# Altium schematic sheet cc2520_cc2592.SchDoc: Edison Gateway - CC2520
size Letter; Author: Ye-Sheng Kuo; DocumentNumber: 9; Revision: 3; SheetNumber: 9; SheetTotal: 10
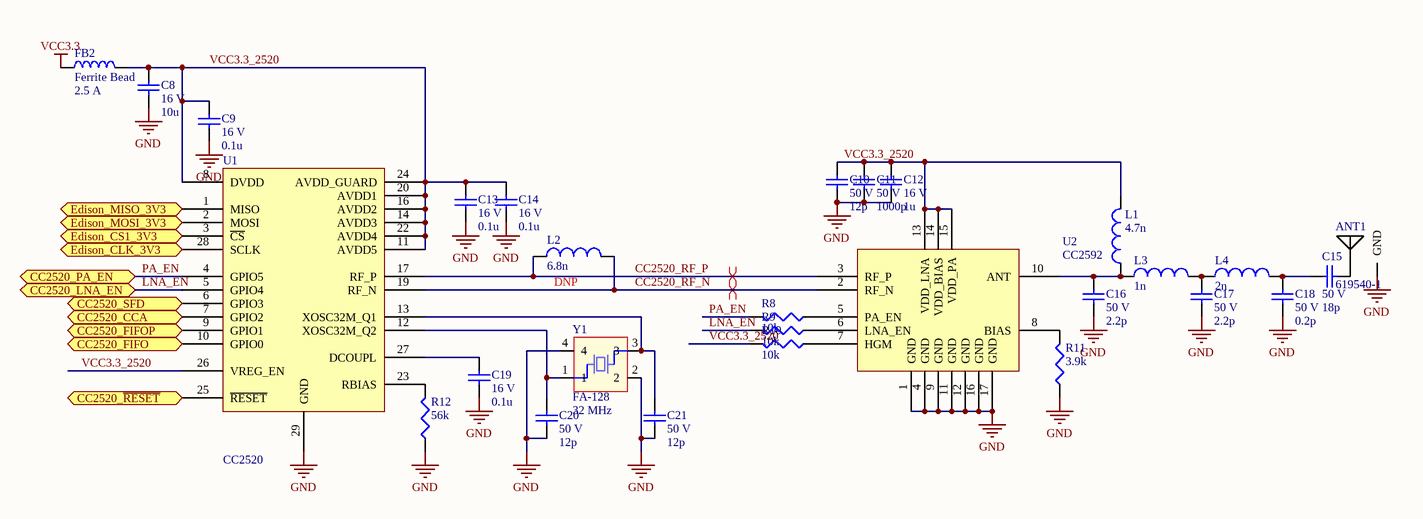
[diagram p0: cc2520_cc2592.SchDoc]

## Parts
ANT1  619540-1  [619540-1]
C8  voltage rated: 16 V  [0603]  (hidden comment: 10u)
C9  voltage rated: 16 V  [0402]  (hidden comment: 0.1u)
C10  voltage rated: 50 V  [0402]  (hidden comment: 12p)
C11  voltage rated: 50 V  [0402]  (hidden comment: 1000p)
C12  voltage rated: 16 V  [0402]  (hidden comment: 1u)
C13  voltage rated: 16 V  [0402]  (hidden comment: 0.1u)
C14  voltage rated: 16 V  [0402]  (hidden comment: 0.1u)
C15  voltage rated: 50 V  [0402]  (hidden comment: 18p)
C16  voltage rated: 50 V  [0402]  (hidden comment: 2.2p)
C17  voltage rated: 50 V  [0402]  (hidden comment: 2.2p)
C18  voltage rated: 50 V  [0402]  (hidden comment: 0.2p)
C19  voltage rated: 16 V  [0402]  (hidden comment: 0.1u)
C20  voltage rated: 50 V  [0402]  (hidden comment: 12p)
C21  voltage rated: 50 V  [0402]  (hidden comment: 12p)
FB2  Ferrite Bead  Current Rating (Max): 2.5 A  [0603]
L1  4.7n  [0402]
L2  Note: DNP  [0402]  (hidden comment: 6.8n)
L3  1n  [0402]
L4  2n  [0402]
R8  10k  [0402]
R9  10k  [0402]
R10  10k  [0402]
R11  3.9k  [0402]
R12  56k  [0402]
U1  CC2520  [QFN-28]
U2  CC2592  [QFN-16]
Y1  FA-128  frequency: 32 MHz  [FA-128]

## Ports
CC2520_CCA, CC2520_FIFO, CC2520_FIFOP, CC2520_LNA_EN, CC2520_PA_EN, CC2520_SFD, CC2520_~{RESET}, Edison_CLK_3V3, Edison_CS1_3V3, Edison_MISO_3V3, Edison_MOSI_3V3

## Nets
GND: ANT1.1(GND) C8.2 C9.2 C10.2 C11.2 C12.2 C13.2 C14.2 C16.2 C17.2 C18.2 C19.2 C20.1 C21.1 R11.2 R12.2 U1.29(GND) U2.1(GND) U2.4(GND) U2.9(GND) U2.11(GND) U2.12(GND) U2.16(GND) U2.17(GND) Y1.2 Y1.4
VCC3.3: FB2.2
CC2520_CCA: U1.7(GPIO2) ; port CC2520_CCA
CC2520_FIFO: U1.10(GPIO0) ; port CC2520_FIFO
CC2520_FIFOP: U1.9(GPIO1) ; port CC2520_FIFOP
CC2520_~{RESET}: U1.25(~{RESET}) ; port CC2520_~{RESET}
CC2520_RF_N: L2.1 U1.19(RF_N) U2.2(RF_N)
CC2520_RF_P: L2.2 U1.17(RF_P) U2.3(RF_P)
CC2520_SFD: U1.6(GPIO3) ; port CC2520_SFD
Edison_CLK_3V3: U1.28(SCLK) ; port Edison_CLK_3V3
Edison_CS1_3V3: U1.3(~{CS}) ; port Edison_CS1_3V3
Edison_MISO_3V3: U1.1(MISO) ; port Edison_MISO_3V3
Edison_MOSI_3V3: U1.2(MOSI) ; port Edison_MOSI_3V3
LNA_EN: R9.1 U1.5(GPIO4) ; port CC2520_LNA_EN
PA_EN: R8.1 U1.4(GPIO5) ; port CC2520_PA_EN
VCC3.3_2520: C8.1 C9.1 C10.1 C11.1 C12.1 C13.1 C14.1 FB2.1 L1.1 R10.1 U1.8(DVDD) U1.11(AVDD5) U1.14(AVDD3) U1.16(AVDD2) U1.20(AVDD1) U1.22(AVDD4) U1.24(AVDD_GUARD) U1.26(VREG_EN) U2.13(VDD_LNA) U2.14(VDD_BIAS) U2.15(VDD_PA)
NetANT1_2: ANT1.2 C15.2
NetC15_1: C15.1 C18.1 L4.1
NetC16_1: C16.1 L1.2 L3.2 U2.10(ANT)
NetC17_1: C17.1 L3.1 L4.2
NetC19_1: C19.1 U1.27(DCOUPL)
NetC20_2: C20.2 U1.12(XOSC32M_Q2) Y1.1
NetC21_2: C21.2 U1.13(XOSC32M_Q1) Y1.3
NetR8_2: R8.2 U2.5(PA_EN)
NetR9_2: R9.2 U2.6(LNA_EN)
NetR10_2: R10.2 U2.7(HGM)
NetR11_1: R11.1 U2.8(BIAS)
NetR12_1: R12.1 U1.23(RBIAS)

## Layout directives
differential pair: CC2520_RF_N, CC2520_RF_P

## Notes on the sheet
- Title
- Date:
- Author:
- Revision:
- Sheet
- of
- University of Michigan
- File:

## Library data of the parts
ANT1 = 619540-1: CONN SMA JACK; Supplier 1: Digi-Key; Supplier Part Number 1: A120734-ND
C8 = GRM188C81C106MA73D: 10µF ±20% 16V Ceramic Capacitor X6S 0603; Manufacture: Murata; tolerance: 20%; package: 0603; Temperature Coefficient: X6S; Supplier 1: Digi-Key; Supplier Part Number 1: 490-7198-1-ND; Value: 10u; Manufacturer Part Number: GRM188C81C106MA73D
C9 C13 C14 C19 = GRM155R71C104KA88D: 0.10µF ±10% 16V Ceramic Capacitor X7R 0402; Manufacture: Murata; tolerance: 10%; package: 0402; Supplier 1: Digi-Key; Supplier Part Number 1: 490-3261-1-ND; Value: 0.1u; Temperature Coefficient: X7R; Manufacturer Part Number: GRM155R71C104KA88D
C10 C20 C21 = 500R07S120GV4T: 12pF ±2% 50V Ceramic Capacitor C0G, NP0 0402; Manufacture: Johanson Technology Inc.; Note: RF application; tolerance: 2%; package: 0402; Supplier 1: Digi-Key; Supplier Part Number 1: 712-1256-1-ND; Value: 12p; Temperature Coefficient: C0G, NP0; Manufacturer Part Number: 500R07S120GV4T
C11 = C1005C0G1H102J050BA: 1000pF ±5% 50V Ceramic Capacitor C0G, NP0 0402; Manufacture: TDK; tolerance: 5%; package: 0402; Supplier 1: Digi-Key; Supplier Part Number 1: 445-6846-1-ND; Value: 1000p; Temperature Coefficient: C0G, NP0; Manufacturer Part Number: C1005C0G1H102J050BA
C12 = C1005X6S1C105K050BC: 1µF ±10% 16V Ceramic Capacitor X6S 0402; Manufacture: TDK; tolerance: 10%; package: 0402; Supplier 1: Digi-Key; Supplier Part Number 1: 445-9086-1-ND; Value: 1u; Temperature Coefficient: X6S; Manufacturer Part Number: C1005X6S1C105K050BC
C15 = 500R07S180GV4T: 18pF ±2% 50V Ceramic Capacitor C0G, NP0 0402; Manufacture: Johanson Technology Inc.; Note: RF application; tolerance: 2%; package: 0402; Temperature Coefficient: C0G, NP0; Supplier 1: Digi-Key; Supplier Part Number 1: 712-1264-1-ND; Value: 18p; Manufacturer Part Number: 500R07S180GV4T
C16 C17 = 500R07S2R2BV4T: 2.2pF ±0.1pF 50V Ceramic Capacitor C0G, NP0; Manufacture: Johanson Technology Inc.; tolerance: 0.1p; package: 0402; Temperature Coefficient: C0G, NP0; Supplier 1: Digi-Key; Supplier Part Number 1: 712-1279-1-ND; Value: 2.2p; Manufacturer Part Number: 500R07S2R2BV4T
C18 = 500R07S0R2AV4T: 0.20pF ±0.05pF 50V Ceramic Capacitor C0G, NP0 0402; Manufacture: Johanson Technology Inc.; tolerance: 0.05p; Note: RF application; package: 0402; Temperature Coefficient: C0G, NP0; Supplier 1: Digi-Key; Supplier Part Number 1: 712-1244-1-ND; Value: 0.2p; Manufacturer Part Number: 500R07S0R2AV4T
FB2 = BLM18SG221TN1D: FERRITE BEAD 220 OHM 0603; Manufacturer: Murata; DC resistance: 40m; Impedance @ Frequency: 220 Ohm @ 100MHz; package: 0603; Supplier 1: Digi-Key; Supplier Part Number 1: 490-5225-1-ND; Manufacturer Part Number: BLM18SG221TN1D
L1 = LQG15HS4N7S02D: 4.7nH Unshielded Multilayer Inductor 300mA 180 mOhm Max 0402 (1005 Metric); Manufacturer: Murata; tolerance: 0.3n; DCR (Max): 180m; package: 0402; Current Rating: 300 mA; Supplier 1: Digi-Key; Supplier Part Number 1: 490-2618-1-ND; Value: 4.7n; Manufacturer Part Number: LQG15HS4N7S02D
L2 = L-07C6N8JV6T: 6.8nH Unshielded Multilayer Inductor 250mA 320 mOhm Max 0402 (1005 Metric); Manufacturer: Johanson Technology Inc.; tolerance: 5%; DCR (Max): 320m; package: 0402; Supplier 1: Digi-Key; Supplier Part Number 1: 712-1419-1-ND; Value: 6.8n; Current Rating: 250 mA; Manufacturer Part Number: L-07C6N8JV6T
L3 = LQG15HN1N0S02D: 1nH Unshielded Multilayer Inductor 300mA 100 mOhm Max 0402 (1005 Metric); Manufacturer: Murata; tolerance: 0.3n; DCR (Max): 100m; package: 0402; Current Rating: 300 mA; Supplier 1: Digi-Key; Supplier Part Number 1: 490-1073-1-ND; Value: 1n; Manufacturer Part Number: LQG15HN1N0S02D
L4 = LQG15HN2N0S02D: 2nH Unshielded Multilayer Inductor 300mA 120 mOhm Max 0402 (1005 Metric); Manufacturer: Murata; tolerance: 0.3n; DCR (Max): 120m; package: 0402; Current Rating: 300 mA; Supplier 1: Digi-Key; Supplier Part Number 1: 490-6558-1-ND; Value: 2n; Manufacturer Part Number: LQG15HN2N0S02D
R8-R10 = CRCW040210K0FKED: RES SMD 10K OHM 1% 1/16W 0402; Manufacturer: Vishay Dale; Temperature Coefficient: 100 ppm/C; Tolerance: 1%; Power: 1/16 W; package: 0402; Supplier 1: Digi-Key; Supplier Part Number 1: 541-10.0KLCT-ND; value: 10k; Manufacturer Part Number: CRCW040210K0FKED
R11 = RC0402FR-073K9L: RES SMD 3.9K OHM 1% 1/16W 0402; Manufacturer: Yageo; Temperature Coefficient: 100 ppm/C; Tolerance: 1%; Power: 1/16 W; package: 0402; Supplier 1: Digi-Key; Supplier Part Number 1: 311-3.90KLRCT-ND; value: 3.9k; Manufacturer Part Number: RC0402FR-073K9L
R12 = CRCW040256K0FKED: RES SMD 56K OHM 1% 1/16W 0402; Manufacturer: Vishay Dale; Temperature Coefficient: 100 ppm/C; Power: 1/16 W; package: 0402; Supplier 1: Digi-Key; Supplier Part Number 1: 541-56.0KLCT-ND; Tolerance: 1%; value: 56k; Manufacturer Part Number: CRCW040256K0FKED
U1 = CC2520: 2.4 GHZ IEEE 802.15.4/ZIGBEE® RF TRANSCEIVER; Supplier 1: Digi-Key; Supplier Part Number 1: 296-38897-1-ND
U2 = CC2592: 2.4-GHz Range Extender; Supplier 1: Digi-Key; Supplier Part Number 1: 296-37475-1-ND
Y1 = FA-128: MHz Range Crystal Unit; Load capatance: 10 pF; ESR: 60; stability: 20 ppm; Supplier 1: Digi-Key; Supplier Part Number 1: SER4079CT-ND